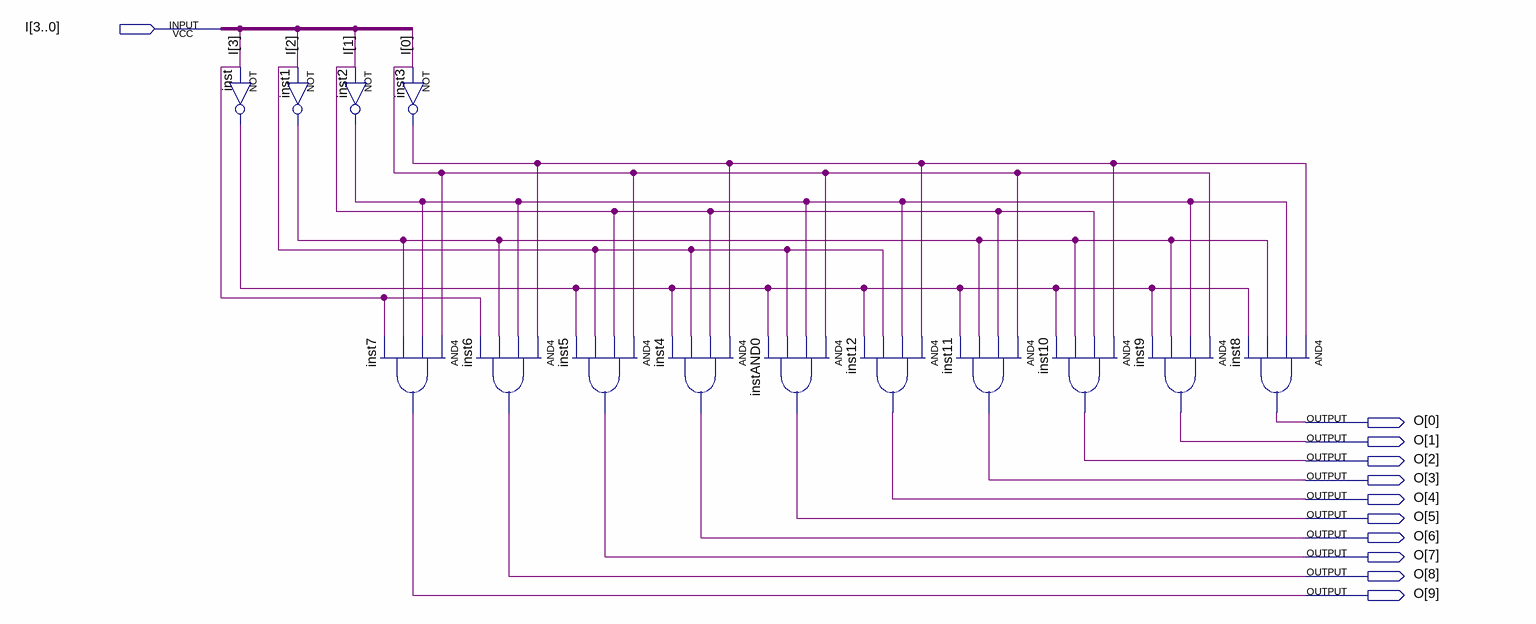
[diagram p0: schematic sheet]
// Quartus schematic Decode4To10.bdf as structural Verilog: 14 symbols, 11 pins
module Decode4To10 (
  input  [3:0] I,
  output [9:0] O
);

  wire inst1_out, inst2_out, inst3_out, inst_out;

  not inst (inst_out, I[3]);
  not inst1 (inst1_out, I[2]);
  not inst2 (inst2_out, I[1]);
  and inst7 (O[9], I[0], inst2_out, inst1_out, I[3]);
  not inst3 (inst3_out, I[0]);
  and inst6 (O[8], inst3_out, inst2_out, inst1_out, I[3]);
  and inst5 (O[7], I[0], I[1], I[2], inst_out);
  and inst4 (O[6], inst3_out, I[1], I[2], inst_out);
  and instAND0 (O[5], I[0], inst2_out, I[2], inst_out);
  and inst12 (O[4], inst3_out, inst2_out, I[2], inst_out);
  and inst11 (O[3], I[0], I[1], inst1_out, inst_out);
  and inst10 (O[2], inst3_out, I[1], inst1_out, inst_out);
  and inst9 (O[1], I[0], inst2_out, inst1_out, inst_out);
  and inst8 (O[0], inst3_out, inst2_out, inst1_out, inst_out);
endmodule
